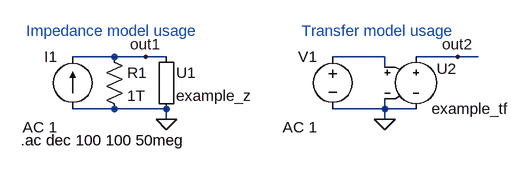
[diagram p0: schematic test.asc]
test.asc, the LTspice schematic file:
Version 4
SHEET 1 880 680
WIRE -144 128 -208 128
WIRE -96 128 -144 128
WIRE -64 128 -96 128
WIRE 272 128 192 128
WIRE 384 128 320 128
WIRE 416 128 384 128
WIRE 272 144 272 128
WIRE -144 208 -208 208
WIRE -64 208 -144 208
WIRE 272 208 272 192
WIRE 272 208 192 208
WIRE 320 208 272 208
WIRE -64 224 -64 208
WIRE 272 224 272 208
FLAG 272 224 0
FLAG -64 224 0
FLAG -96 128 out1
FLAG 384 128 out2
SYMBOL example_z -80 112 R0
SYMATTR InstName U1
SYMBOL example_tf 320 112 R0
WINDOW 0 32 34 Left 2
SYMATTR InstName U2
SYMBOL current -208 208 R180
WINDOW 0 24 80 Left 2
WINDOW 3 24 0 Left 2
WINDOW 123 24 -28 Left 2
WINDOW 39 0 0 Left 0
SYMATTR InstName I1
SYMATTR Value ""
SYMATTR Value2 AC 1
SYMBOL res -160 112 R0
SYMATTR InstName R1
SYMATTR Value 1T
SYMBOL voltage 192 112 M0
WINDOW 123 24 124 Left 2
WINDOW 39 0 0 Left 0
SYMATTR InstName V1
SYMATTR Value ""
SYMATTR Value2 AC 1
TEXT -288 256 Left 2 !.ac dec 100 100 50meg
TEXT -280 88 Left 2 ;Impedance model usage
TEXT 144 88 Left 2 ;Transfer model usage

The netlist it stands for:
* test.asc
XU1 out1 0 example_z  ; pins A B
XU2 out2 0 N001 0 example_tf  ; pins + - P N
I1 0 out1 AC 1
R1 out1 0 1T
V1 N001 0 AC 1
.ac dec 100 100 50meg
* Impedance model usage
* Transfer model usage
.lib example_z.sub
.lib example_tf.sub
.backanno
.end